# EAGLE design FlashProgrammer03 (EAGLE 9.4.2)
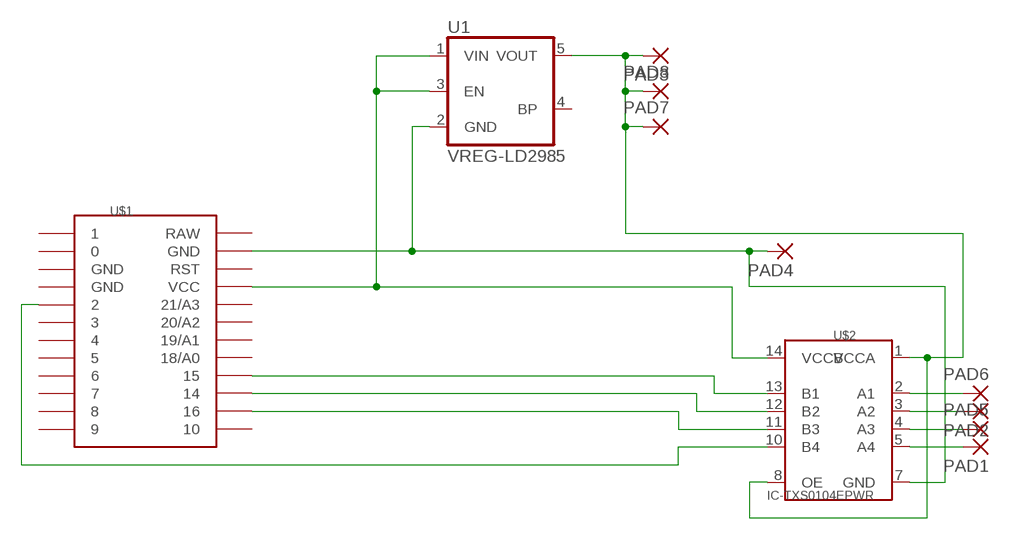
[diagram p0: schematic, sheet 1]

## Parts
PAD1  1,6/0,8  [1,6/0,8]
PAD2  1,6/0,8  [1,6/0,8]
PAD3  1,6/0,8  [1,6/0,8]
PAD4  1,6/0,8  [1,6/0,8]
PAD5  1,6/0,8  [1,6/0,8]
PAD6  1,6/0,8  [1,6/0,8]
PAD7  1,6/0,8  [1,6/0,8]
PAD8  1,6/0,8  [1,6/0,8]
U1  VREG-LD2985  [SOT95P280X145-5]
U$1  PROMICRO  [PROMICRO]
U$2  IC-TXS0104EPWR  [TSSOP14]

## Nets
N$1: U$1.2 U$2.10(B4)
N$2: PAD4.1(P) U1.2(GND) U$1.GND@1(GND) U$2.7(GND)
N$3: U$1.15 U$2.13(B1)
N$4: PAD3.1(P) PAD7.1(P) PAD8.1(P) U1.5(VOUT) U$2.1(VCCA) U$2.8(OE)
N$5: U$1.14 U$2.12(B2)
N$6: U$1.16 U$2.11(B3)
N$7: U1.1(VIN) U1.3(EN) U$1.VCC U$2.14(VCCB)
N$8: PAD6.1(P) U$2.2(A1)
N$9: PAD2.1(P) U$2.3(A2)
N$10: PAD5.1(P) U$2.4(A3)
N$11: PAD1.1(P) U$2.5(A4)
Unconnected: U1.4(BP) U$1.3 U$1.4 U$1.5 U$1.6 U$1.7 U$1.8 U$1.9 U$1.10 U$1.18/A0 U$1.19/A1 U$1.20/A2 U$1.21/A3 U$1.GND@3(GND) U$1.RST

## Power pins joined to a net without a drawn wire
0: U$1.0
1: U$1.1
GND: U$1.GND@2(GND)
RAW: U$1.RAW

## Library data of the parts
PAD1-PAD8 = wirepad:1,6/0,8: THROUGH-HOLE PAD
U1 = Flamberm:VREG-LD2985
U$1 = Flamberm:PROMICRO
U$2 = Flamberm:IC-TXS0104EPWR

## Board
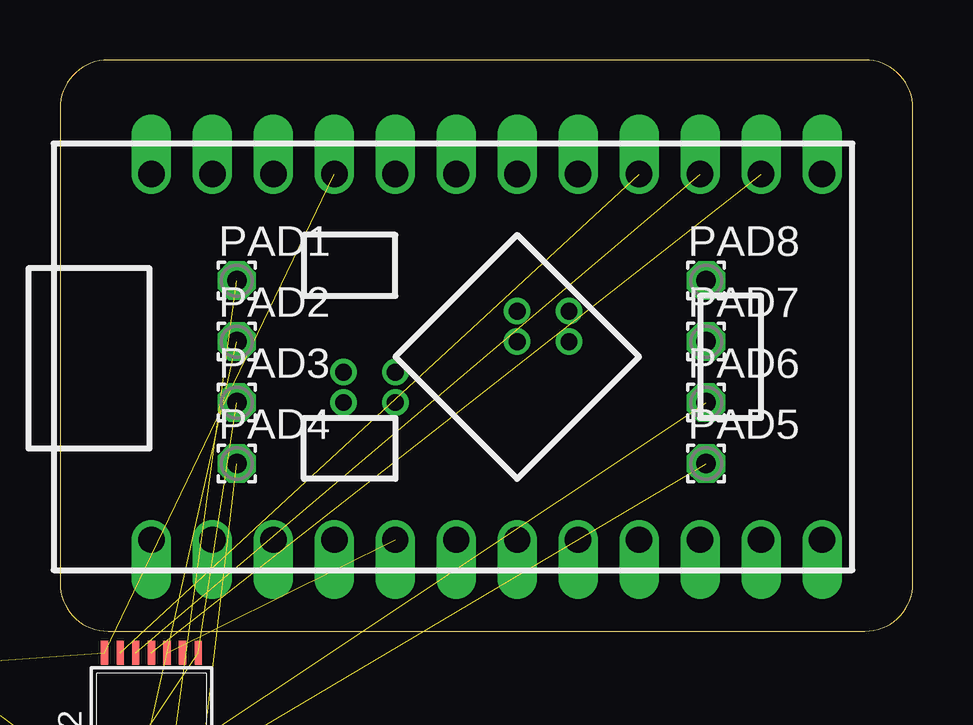
[diagram p1: board, top side]
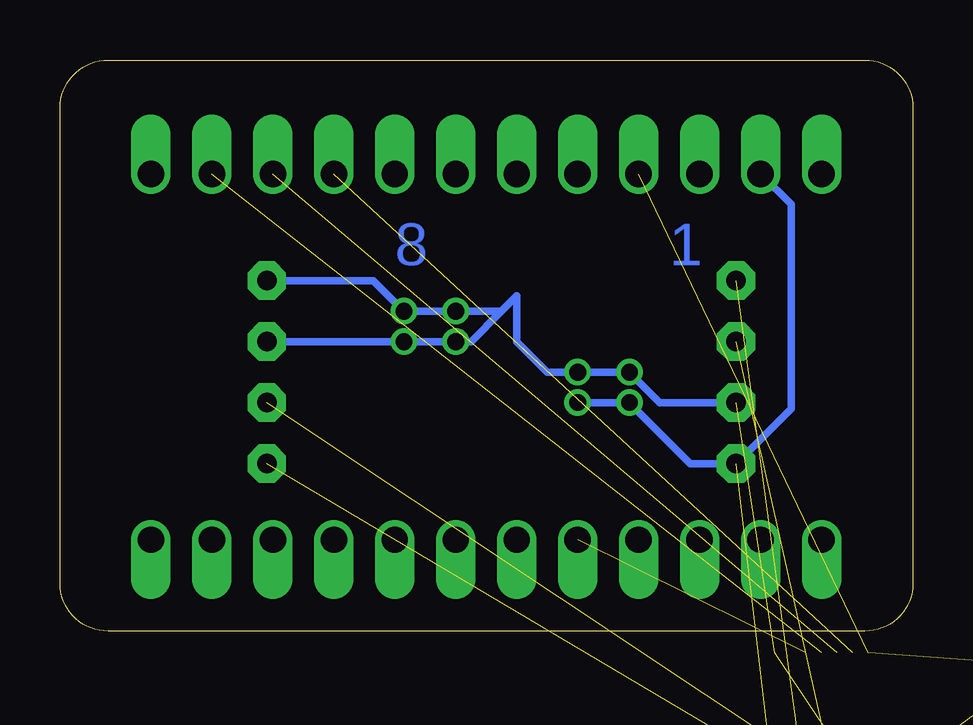
[diagram p2: board, bottom side, seen from below]

Size 35.54 x 23.8 mm. Coordinates in mm from the lower left corner, seen from the top.
Outline: 0,21.8 0,2 arc90 2,0 33.54,0 arc90 35.54,2 35.54,21.8 arc90 33.54,23.8 2,23.8 arc90 0,21.8
Copper layers (1*16): Top 0.035mm / dielectric 1.5mm / Bottom 0.035mm
Design rules "default": minimum track width 6mil, minimum drill 0.35mm, track to track 6mil, track to pad 6mil, pad to pad 6mil, via to via 6mil, smd to smd 6mil, copper to edge 40mil, drill to drill 6mil, minimum pad ring 10mil, minimum via ring 8mil, stop-mask expansion 4mil, vias tented up to drill 0mil, thermal gap 10mil

### Footprints (pad centres in the part's own frame; a part is rotated, then mirrored left to right if it is on the bottom)
1,6/0,8 = drill 0.813 pad 1.6 octagon: 1 0,0
SOT95P280X145-5 = smd 1.127 x 0.589: 1 -1.242,0.95; 2 -1.242,0; 3 -1.242,-0.95; 4 1.242,-0.95; 5 1.242,0.95
PROMICRO = drill 1.1 offset: 0 -7.62,10.16; 1 -7.62,12.7; 2 -7.62,2.54; 3 -7.62,0; 4 -7.62,-2.54; 5 -7.62,-5.08; 6 -7.62,-7.62; 7 -7.62,-10.16; 8 -7.62,-12.7; 9 -7.62,-15.24; 10 7.62,-15.24; 14 7.62,-10.16; 15 7.62,-7.62; 16 7.62,-12.7; 18/A0 7.62,-5.08; 19/A1 7.62,-2.54; 20/A2 7.62,0; 21/A3 7.62,2.54; GND@1 7.62,10.16; GND@2 -7.62,5.08; GND@3 -7.62,7.62; RAW 7.62,12.7; RST 7.62,7.62; VCC 7.62,5.08
TSSOP14 = smd 0.305 x 0.991: 1 -1.95,-2.918; 2 -1.3,-2.918; 3 -0.65,-2.918; 4 0,-2.918; 5 0.65,-2.918; 6 1.3,-2.918; 7 1.95,-2.918; 8 1.95,2.918; 9 1.3,2.918; 10 0.65,2.918; 11 0,2.918; 12 -0.65,2.918; 13 -1.3,2.918; 14 -1.95,2.918

### Placement (x,y rotation side)
PAD1  7.37,14.61 0 top
PAD2  7.37,12.06 0 top
PAD3  7.37,9.53 0 top
PAD4  7.37,6.99 0 top
PAD5  26.92,6.99 0 top
PAD6  26.92,9.53 0 top
PAD7  26.92,12.06 0 top
PAD8  26.92,14.61 0 top
U1  -6.35,-2.54 0 top  (outside the outline)
U$1  16.51,11.43 90 top
U$2  3.81,-3.81 0 top

### Tracks (layer width: path | path; a pad name or v marks a point on that pad's centre or on a via)
N$1  (1 unrouted)
N$2  (via drill 0.7)  (2 unrouted)
  Bottom 0.305: v13.97,9.53 v11.81,9.53 9.27,6.99 PAD4.1 5.08,9.27 5.08,17.78 U$1.GND@1
N$3  (1 unrouted)
N$4  (via drill 0.7)  (3 unrouted)
  Bottom 0.305: PAD8.1 22.48,14.61 v21.21,13.34 v19.05,13.34 17.14,13.34 | PAD7.1 v21.21,12.06 v19.05,12.06 18.41,12.06 17.14,13.34 | PAD3.1 10.54,9.53 v11.81,10.79 v13.97,10.79 15.24,10.79 16.51,12.06 16.51,13.97 17.14,13.34
N$5  (1 unrouted)
N$6  (1 unrouted)
N$7  (3 unrouted)
N$8  (1 unrouted)
N$9  (1 unrouted)
N$10  (1 unrouted)
N$11  (1 unrouted)

### Text on the board
Bottom: 1 | 8